# Altium schematic sheet SNES_DRONE_MAIN.SchDoc
size A4
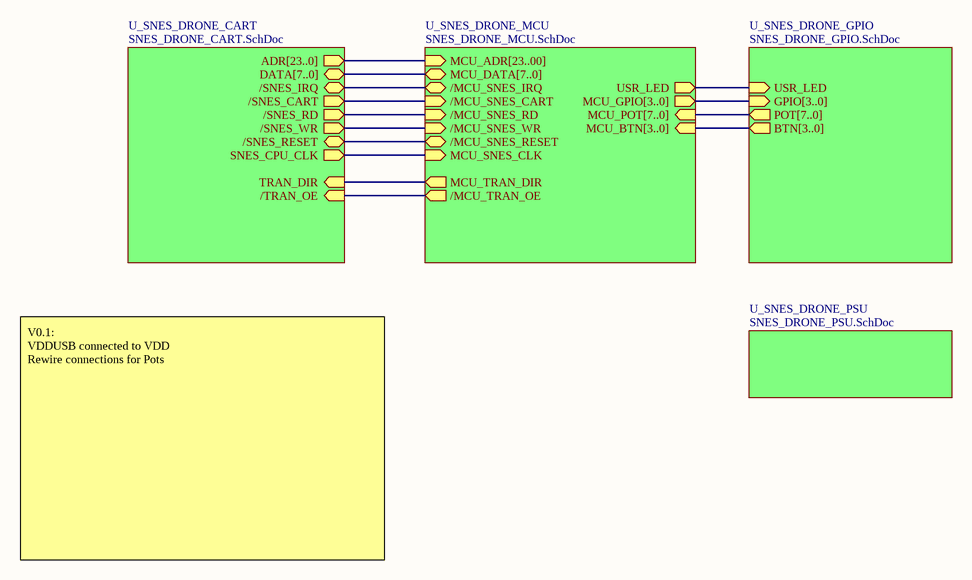
[diagram p0: SNES_DRONE_MAIN.SchDoc]

## Sub-sheets
U_SNES_DRONE_CART = SNES_DRONE_CART.SchDoc: DATA[7..0] (bidir), ADR[23..0] (out), /SNES_CART (out), /SNES_RD (out), /SNES_WR (out), SNES_CPU_CLK (out), TRAN_DIR (in), /TRAN_OE (in), /SNES_IRQ (bidir), /SNES_RESET (bidir)
U_SNES_DRONE_GPIO = SNES_DRONE_GPIO.SchDoc: POT[7..0] (out), BTN[3..0] (out), GPIO[3..0] (in), USR_LED (in)
U_SNES_DRONE_MCU = SNES_DRONE_MCU.SchDoc: MCU_ADR[23..00] (in), MCU_DATA[7..0] (bidir), /MCU_TRAN_OE (out), MCU_TRAN_DIR (out), /MCU_SNES_CART (in), /MCU_SNES_RD (in), /MCU_SNES_WR (in), MCU_SNES_CLK (in), MCU_POT[7..0] (in), USR_LED (out), MCU_GPIO[3..0] (out), MCU_BTN[3..0] (in), /MCU_SNES_IRQ (bidir), /MCU_SNES_RESET (bidir)
U_SNES_DRONE_PSU = SNES_DRONE_PSU.SchDoc: no entries

## Nets
(unnamed): sheet U_SNES_DRONE_CART//SNES_CART, sheet U_SNES_DRONE_MCU//MCU_SNES_CART
(unnamed): sheet U_SNES_DRONE_CART//SNES_RD, sheet U_SNES_DRONE_MCU//MCU_SNES_RD
(unnamed): sheet U_SNES_DRONE_CART//SNES_WR, sheet U_SNES_DRONE_MCU//MCU_SNES_WR
(unnamed): sheet U_SNES_DRONE_CART/SNES_CPU_CLK, sheet U_SNES_DRONE_MCU/MCU_SNES_CLK
(unnamed): sheet U_SNES_DRONE_CART/TRAN_DIR, sheet U_SNES_DRONE_MCU/MCU_TRAN_DIR
(unnamed): sheet U_SNES_DRONE_CART//TRAN_OE, sheet U_SNES_DRONE_MCU//MCU_TRAN_OE
(unnamed): sheet U_SNES_DRONE_CART//SNES_IRQ, sheet U_SNES_DRONE_MCU//MCU_SNES_IRQ
(unnamed): sheet U_SNES_DRONE_CART//SNES_RESET, sheet U_SNES_DRONE_MCU//MCU_SNES_RESET
(unnamed): sheet U_SNES_DRONE_GPIO/USR_LED, sheet U_SNES_DRONE_MCU/USR_LED

## Buses and harness runs
bus sheet U_SNES_DRONE_CART/ADR[23..0] = sheet U_SNES_DRONE_MCU/MCU_ADR[23..00]
bus sheet U_SNES_DRONE_CART/DATA[7..0] = sheet U_SNES_DRONE_MCU/MCU_DATA[7..0]
bus sheet U_SNES_DRONE_GPIO/BTN[3..0] = sheet U_SNES_DRONE_MCU/MCU_BTN[3..0]
bus sheet U_SNES_DRONE_GPIO/GPIO[3..0] = sheet U_SNES_DRONE_MCU/MCU_GPIO[3..0]
bus sheet U_SNES_DRONE_GPIO/POT[7..0] = sheet U_SNES_DRONE_MCU/MCU_POT[7..0]

## Notes on the sheet
- V0.1:
  VDDUSB connected to VDD
  Rewire connections for Pots